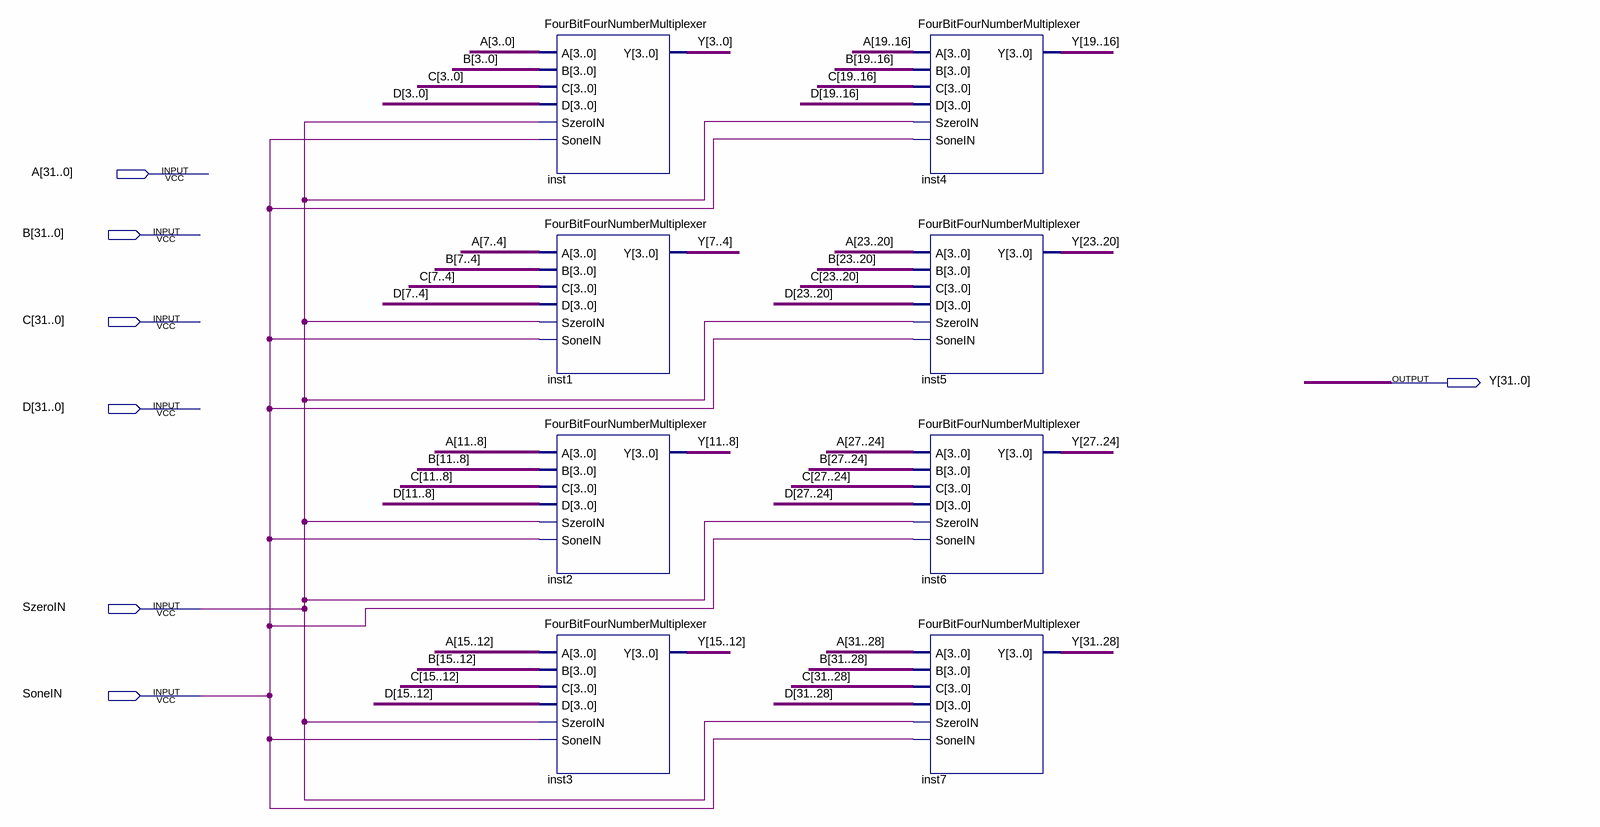
[diagram p0: schematic sheet]
// Quartus schematic ThirtytwoBitFourNumberMultiplexer.bdf as structural Verilog: 8 symbols, 7 pins
module ThirtytwoBitFourNumberMultiplexer (
  input  [31:0] A,
  input  [31:0] B,
  input  [31:0] C,
  input  [31:0] D,
  input  SzeroIN,
  input  SoneIN,
  output [31:0] Y
);

  FourBitFourNumberMultiplexer inst (
    .A(A[3:0]), .B(B[3:0]), .C(C[3:0]), .D(D[3:0]), .SzeroIN(SzeroIN), .SoneIN(SoneIN), .Y(Y[3:0]));
  FourBitFourNumberMultiplexer inst1 (
    .A(A[7:4]), .B(B[7:4]), .C(C[7:4]), .D(D[7:4]), .SzeroIN(SzeroIN), .SoneIN(SoneIN), .Y(Y[7:4]));
  FourBitFourNumberMultiplexer inst2 (
    .A(A[11:8]), .B(B[11:8]), .C(C[11:8]), .D(D[11:8]), .SzeroIN(SzeroIN), .SoneIN(SoneIN), .Y(Y[11:8]));
  FourBitFourNumberMultiplexer inst3 (
    .A(A[15:12]), .B(B[15:12]), .C(C[15:12]), .D(D[15:12]), .SzeroIN(SzeroIN), .SoneIN(SoneIN), .Y(Y[15:12]));
  FourBitFourNumberMultiplexer inst4 (
    .A(A[19:16]), .B(B[19:16]), .C(C[19:16]), .D(D[19:16]), .SzeroIN(SzeroIN), .SoneIN(SoneIN), .Y(Y[19:16]));
  FourBitFourNumberMultiplexer inst5 (
    .A(A[23:20]), .B(B[23:20]), .C(C[23:20]), .D(D[23:20]), .SzeroIN(SzeroIN), .SoneIN(SoneIN), .Y(Y[23:20]));
  FourBitFourNumberMultiplexer inst6 (
    .A(A[27:24]), .B(B[27:24]), .C(C[27:24]), .D(D[27:24]), .SzeroIN(SzeroIN), .SoneIN(SoneIN), .Y(Y[27:24]));
  FourBitFourNumberMultiplexer inst7 (
    .A(A[31:28]), .B(B[31:28]), .C(C[31:28]), .D(D[31:28]), .SzeroIN(SzeroIN), .SoneIN(SoneIN), .Y(Y[31:28]));
endmodule
